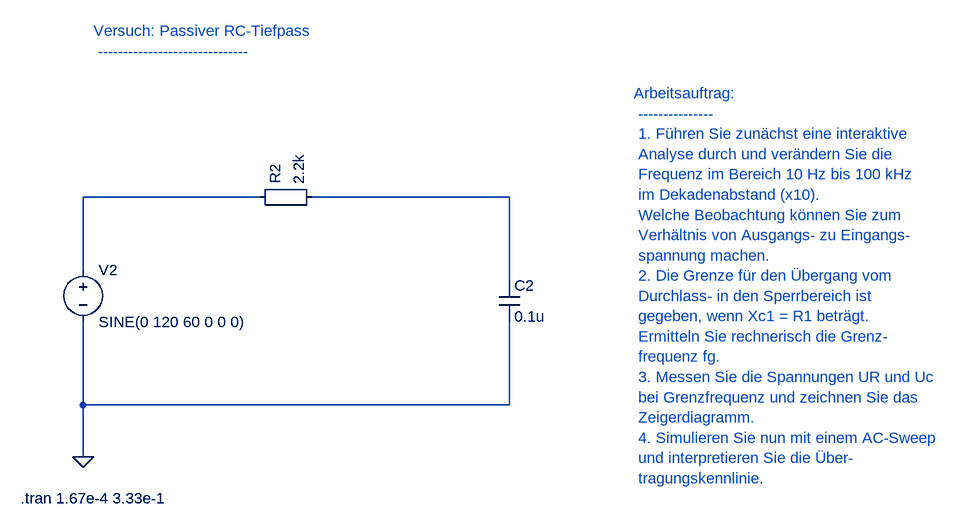
[diagram p0: schematic 10_1_Passiver_RC_Tiefpass.asc]
10_1_Passiver_RC_Tiefpass.asc, the LTspice schematic file:
Version 4
SHEET 1 880 680
WIRE 816 512 816 528
WIRE 160 512 160 528
WIRE 816 528 816 640
WIRE 816 640 160 640
WIRE 512 320 816 320
WIRE 816 320 816 448
WIRE 160 432 160 320
WIRE 160 320 432 320
WIRE 160 640 160 720
WIRE 160 528 160 640
FLAG 160 720 0
SYMBOL Misc\EuropeanResistor 416 336 R270
SYMATTR InstName R2
SYMATTR Value 2.2k
SYMBOL cap 800 448 R0
SYMATTR InstName C2
SYMATTR Value 0.1u
SYMBOL voltage 160 416 R0
SYMATTR InstName V2
SYMATTR Value SINE(0 120 60 0 0 0)
TEXT 64 784 Left 2 !.tran 1.67e-4 3.33e-1
TEXT 176 64 Left 2 ;Versuch: Passiver RC-Tiefpass \n ------------------------------
TEXT 1008 160 Left 2 ;Arbeitsauftrag: \n --------------- \n 1. Führen Sie zunächst eine interaktive \n Analyse durch und verändern Sie die \n Frequenz im Bereich 10 Hz bis 100 kHz \n im Dekadenabstand (x10). \n Welche Beobachtung können Sie zum \n Verhältnis von Ausgangs- zu Eingangs- \n spannung machen. \n 2. Die Grenze für den Übergang vom \n Durchlass- in den Sperrbereich ist \n gegeben, wenn Xc1 = R1 beträgt. \n Ermitteln Sie rechnerisch die Grenz- \n frequenz fg. \n 3. Messen Sie die Spannungen UR und Uc \n bei Grenzfrequenz und zeichnen Sie das \n Zeigerdiagramm. \n 4. Simulieren Sie nun mit einem AC-Sweep \n und interpretieren Sie die Über- \n tragungskennlinie.

The netlist it stands for:
* 10_1_Passiver_RC_Tiefpass.asc
R2 N002 N001 2.2k
C2 N001 0 0.1u
V2 N002 0 SINE(0 120 60 0 0 0)
.tran 1.67e-4 3.33e-1
* Versuch: Passiver RC-Tiefpass
*  ------------------------------
* Arbeitsauftrag:
*  ---------------
*  1. Führen Sie zunächst eine interaktive
*  Analyse durch und verändern Sie die
*  Frequenz im Bereich 10 Hz bis 100 kHz
*  im Dekadenabstand (x10).
*  Welche Beobachtung können Sie zum
*  Verhältnis von Ausgangs- zu Eingangs-
*  spannung machen.
*  2. Die Grenze für den Übergang vom
*  Durchlass- in den Sperrbereich ist
*  gegeben, wenn Xc1 = R1 beträgt.
*  Ermitteln Sie rechnerisch die Grenz-
*  frequenz fg.
*  3. Messen Sie die Spannungen UR und Uc
*  bei Grenzfrequenz und zeichnen Sie das
*  Zeigerdiagramm.
*  4. Simulieren Sie nun mit einem AC-Sweep
*  und interpretieren Sie die Über-
*  tragungskennlinie.
.backanno
.end